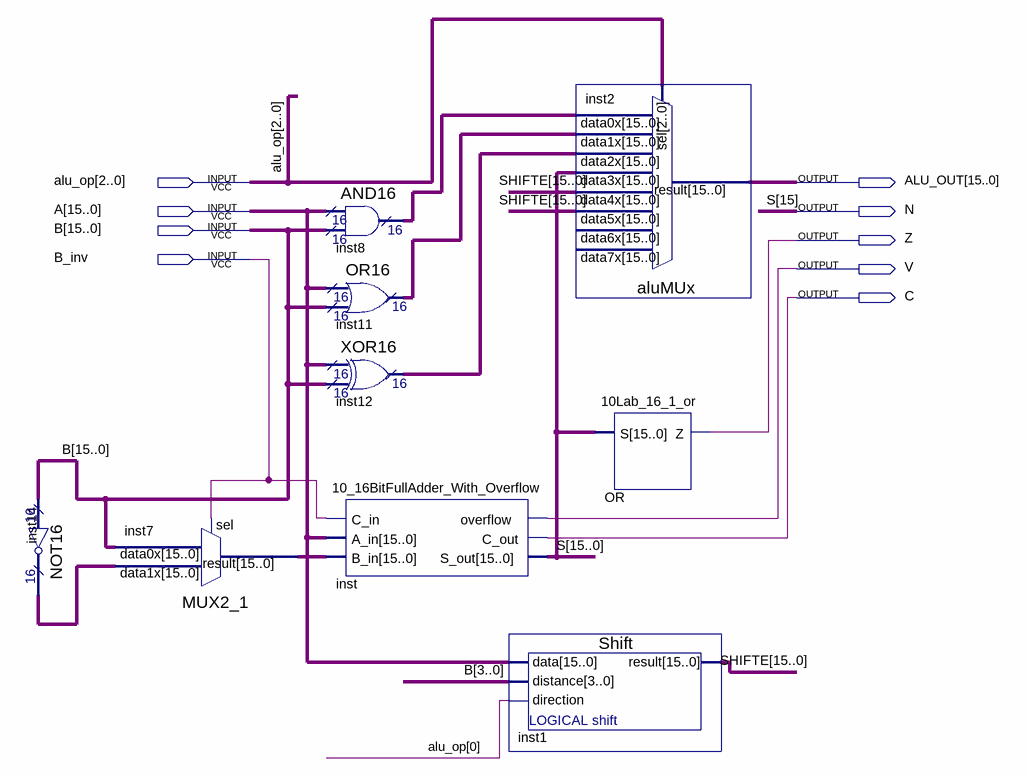
[diagram p0: schematic sheet]
// Quartus schematic 10_ALU_with_overflow.bdf as structural Verilog: 9 symbols, 9 pins
module \10_ALU_with_overflow  (
  input  [2:0] alu_op,
  input  [15:0] A,
  input  [15:0] B,
  input  B_inv,
  output [15:0] ALU_OUT,
  output N,
  output Z,
  output V,
  output C
);

  wire [14:0] S;
  wire [15:0] inst7_result, inst8_result, inst11_result, inst12_result, inst14_result, SHIFTE;

  NOT16 inst14 (.data(B), .result(inst14_result));
  MUX2_1 inst7 (.data1x(inst14_result), .data0x(B), .sel(B_inv), .result(inst7_result));
  AND16 inst8 (.data0x(A), .data1x(B), .result(inst8_result));
  OR16 inst11 (.data0x(A), .data1x(B), .result(inst11_result));
  XOR16 inst12 (.data0x(A), .data1x(B), .result(inst12_result));
  \10_16BitFullAdder_With_Overflow  inst (
    .C_in(B_inv), .A_in(A), .B_in(inst7_result), .overflow(V), .C_out(C), .S_out({N, S}));
  Shift inst1 (.data(A), .distance(B[3:0]), .direction(alu_op[0]), .result(SHIFTE));
  aluMUx inst2 (
    .data5x(SHIFTE), .data4x(SHIFTE), .data3x({N, S}), .data2x(inst12_result), .data1x(inst11_result),
    .data0x(inst8_result), .sel(alu_op), .result(ALU_OUT));  // open: data7x, data6x
  \10Lab_16_1_or  OR (.S({N, S}), .Z(Z));

  // Other names for the same wires on the sheet: S[15] = N
endmodule
